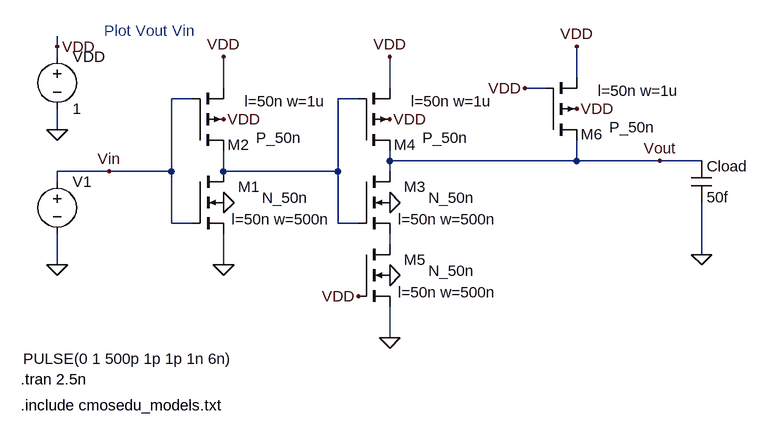
[diagram p0: schematic Fig13_32.asc]
Fig13_32.asc, the LTspice schematic file:
Version 4
SHEET 1 3172 680
WIRE 192 -368 192 -384
WIRE 192 -352 192 -368
WIRE 992 -320 992 -368
WIRE 448 -304 448 -352
WIRE 704 -304 704 -352
WIRE 944 -304 912 -304
WIRE 400 -288 368 -288
WIRE 656 -288 624 -288
WIRE 192 -240 192 -272
WIRE 704 -192 704 -208
WIRE 992 -192 992 -224
WIRE 992 -192 704 -192
WIRE 1120 -192 992 -192
WIRE 1184 -192 1120 -192
WIRE 272 -176 192 -176
WIRE 368 -176 368 -288
WIRE 368 -176 272 -176
WIRE 448 -176 448 -208
WIRE 624 -176 624 -288
WIRE 624 -176 448 -176
WIRE 704 -176 704 -192
WIRE 192 -160 192 -176
WIRE 368 -96 368 -176
WIRE 400 -96 368 -96
WIRE 624 -96 624 -176
WIRE 656 -96 624 -96
WIRE 704 -64 704 -80
WIRE 1184 -48 1184 -128
WIRE 192 -32 192 -80
WIRE 448 -32 448 -80
WIRE 704 80 704 32
FLAG 448 -128 0
FLAG 192 -240 0
FLAG 192 -368 VDD
FLAG 448 -256 VDD
FLAG 448 -32 0
FLAG 448 -352 VDD
FLAG 704 -128 0
FLAG 704 -256 VDD
FLAG 704 80 0
FLAG 704 -352 VDD
FLAG 1184 -48 0
FLAG 192 -32 0
FLAG 1120 -192 Vout
FLAG 272 -176 Vin
FLAG 704 -16 0
FLAG 656 16 VDD
FLAG 992 -272 VDD
FLAG 992 -368 VDD
FLAG 912 -304 VDD
SYMBOL nmos4 400 -176 R0
WINDOW 0 104 24 Right 2
WINDOW 3 179 41 Right 2
WINDOW 123 213 74 Right 2
SYMATTR InstName M1
SYMATTR Value N_50n
SYMATTR Value2 l=50n w=500n
SYMBOL voltage 192 -368 R0
WINDOW 123 0 0 Left 2
WINDOW 39 0 0 Left 2
SYMATTR InstName VDD
SYMATTR Value 1
SYMBOL pmos4 400 -208 M180
WINDOW 0 88 9 Right 2
WINDOW 3 168 20 Right 2
WINDOW 123 206 76 Right 2
SYMATTR InstName M2
SYMATTR Value P_50n
SYMATTR Value2 l=50n w=1u
SYMBOL nmos4 656 -176 R0
WINDOW 0 104 24 Right 2
WINDOW 3 179 41 Right 2
WINDOW 123 213 74 Right 2
SYMATTR InstName M3
SYMATTR Value N_50n
SYMATTR Value2 l=50n w=500n
SYMBOL pmos4 656 -208 M180
WINDOW 0 88 9 Right 2
WINDOW 3 168 20 Right 2
WINDOW 123 206 76 Right 2
SYMATTR InstName M4
SYMATTR Value P_50n
SYMATTR Value2 l=50n w=1u
SYMBOL cap 1168 -192 R0
SYMATTR InstName Cload
SYMATTR Value 50f
SYMBOL voltage 192 -176 R0
WINDOW 3 -52 288 Left 2
WINDOW 123 0 0 Left 2
WINDOW 39 0 0 Left 2
SYMATTR Value PULSE(0 1 500p 1p 1p 1n 6n)
SYMATTR InstName V1
SYMBOL nmos4 656 -64 R0
WINDOW 0 104 24 Right 2
WINDOW 3 179 41 Right 2
WINDOW 123 213 74 Right 2
SYMATTR InstName M5
SYMATTR Value N_50n
SYMATTR Value2 l=50n w=500n
SYMBOL pmos4 944 -224 M180
WINDOW 0 88 9 Right 2
WINDOW 3 168 20 Right 2
WINDOW 123 206 76 Right 2
SYMATTR InstName M6
SYMATTR Value P_50n
SYMATTR Value2 l=50n w=1u
TEXT 136 144 Left 2 !.tran 2.5n
TEXT 136 184 Left 2 !.include cmosedu_models.txt
TEXT 264 -392 Left 2 ;Plot Vout Vin

The netlist it stands for:
* Fig13_32.asc
M1 N001 Vin 0 0 N_50n l=50n w=500n
VDD VDD 0 1
M2 N001 Vin VDD VDD P_50n l=50n w=1u
M3 Vout N001 N002 0 N_50n l=50n w=500n
M4 Vout N001 VDD VDD P_50n l=50n w=1u
Cload Vout 0 50f
V1 Vin 0 PULSE(0 1 500p 1p 1p 1n 6n)
M5 N002 VDD 0 0 N_50n l=50n w=500n
M6 Vout VDD VDD VDD P_50n l=50n w=1u
.model NMOS NMOS
.model PMOS PMOS
.lib standard.mos
.tran 2.5n
.include cmosedu_models.txt
* Plot Vout Vin
.backanno
.end